# EasyEDA schematic schematic.json
TITLE: Sheet_1; REV: 1.0; Date: 2025-02-22; Sheet: 1/1; Drawn By: iminghuang08; Company: Your Company
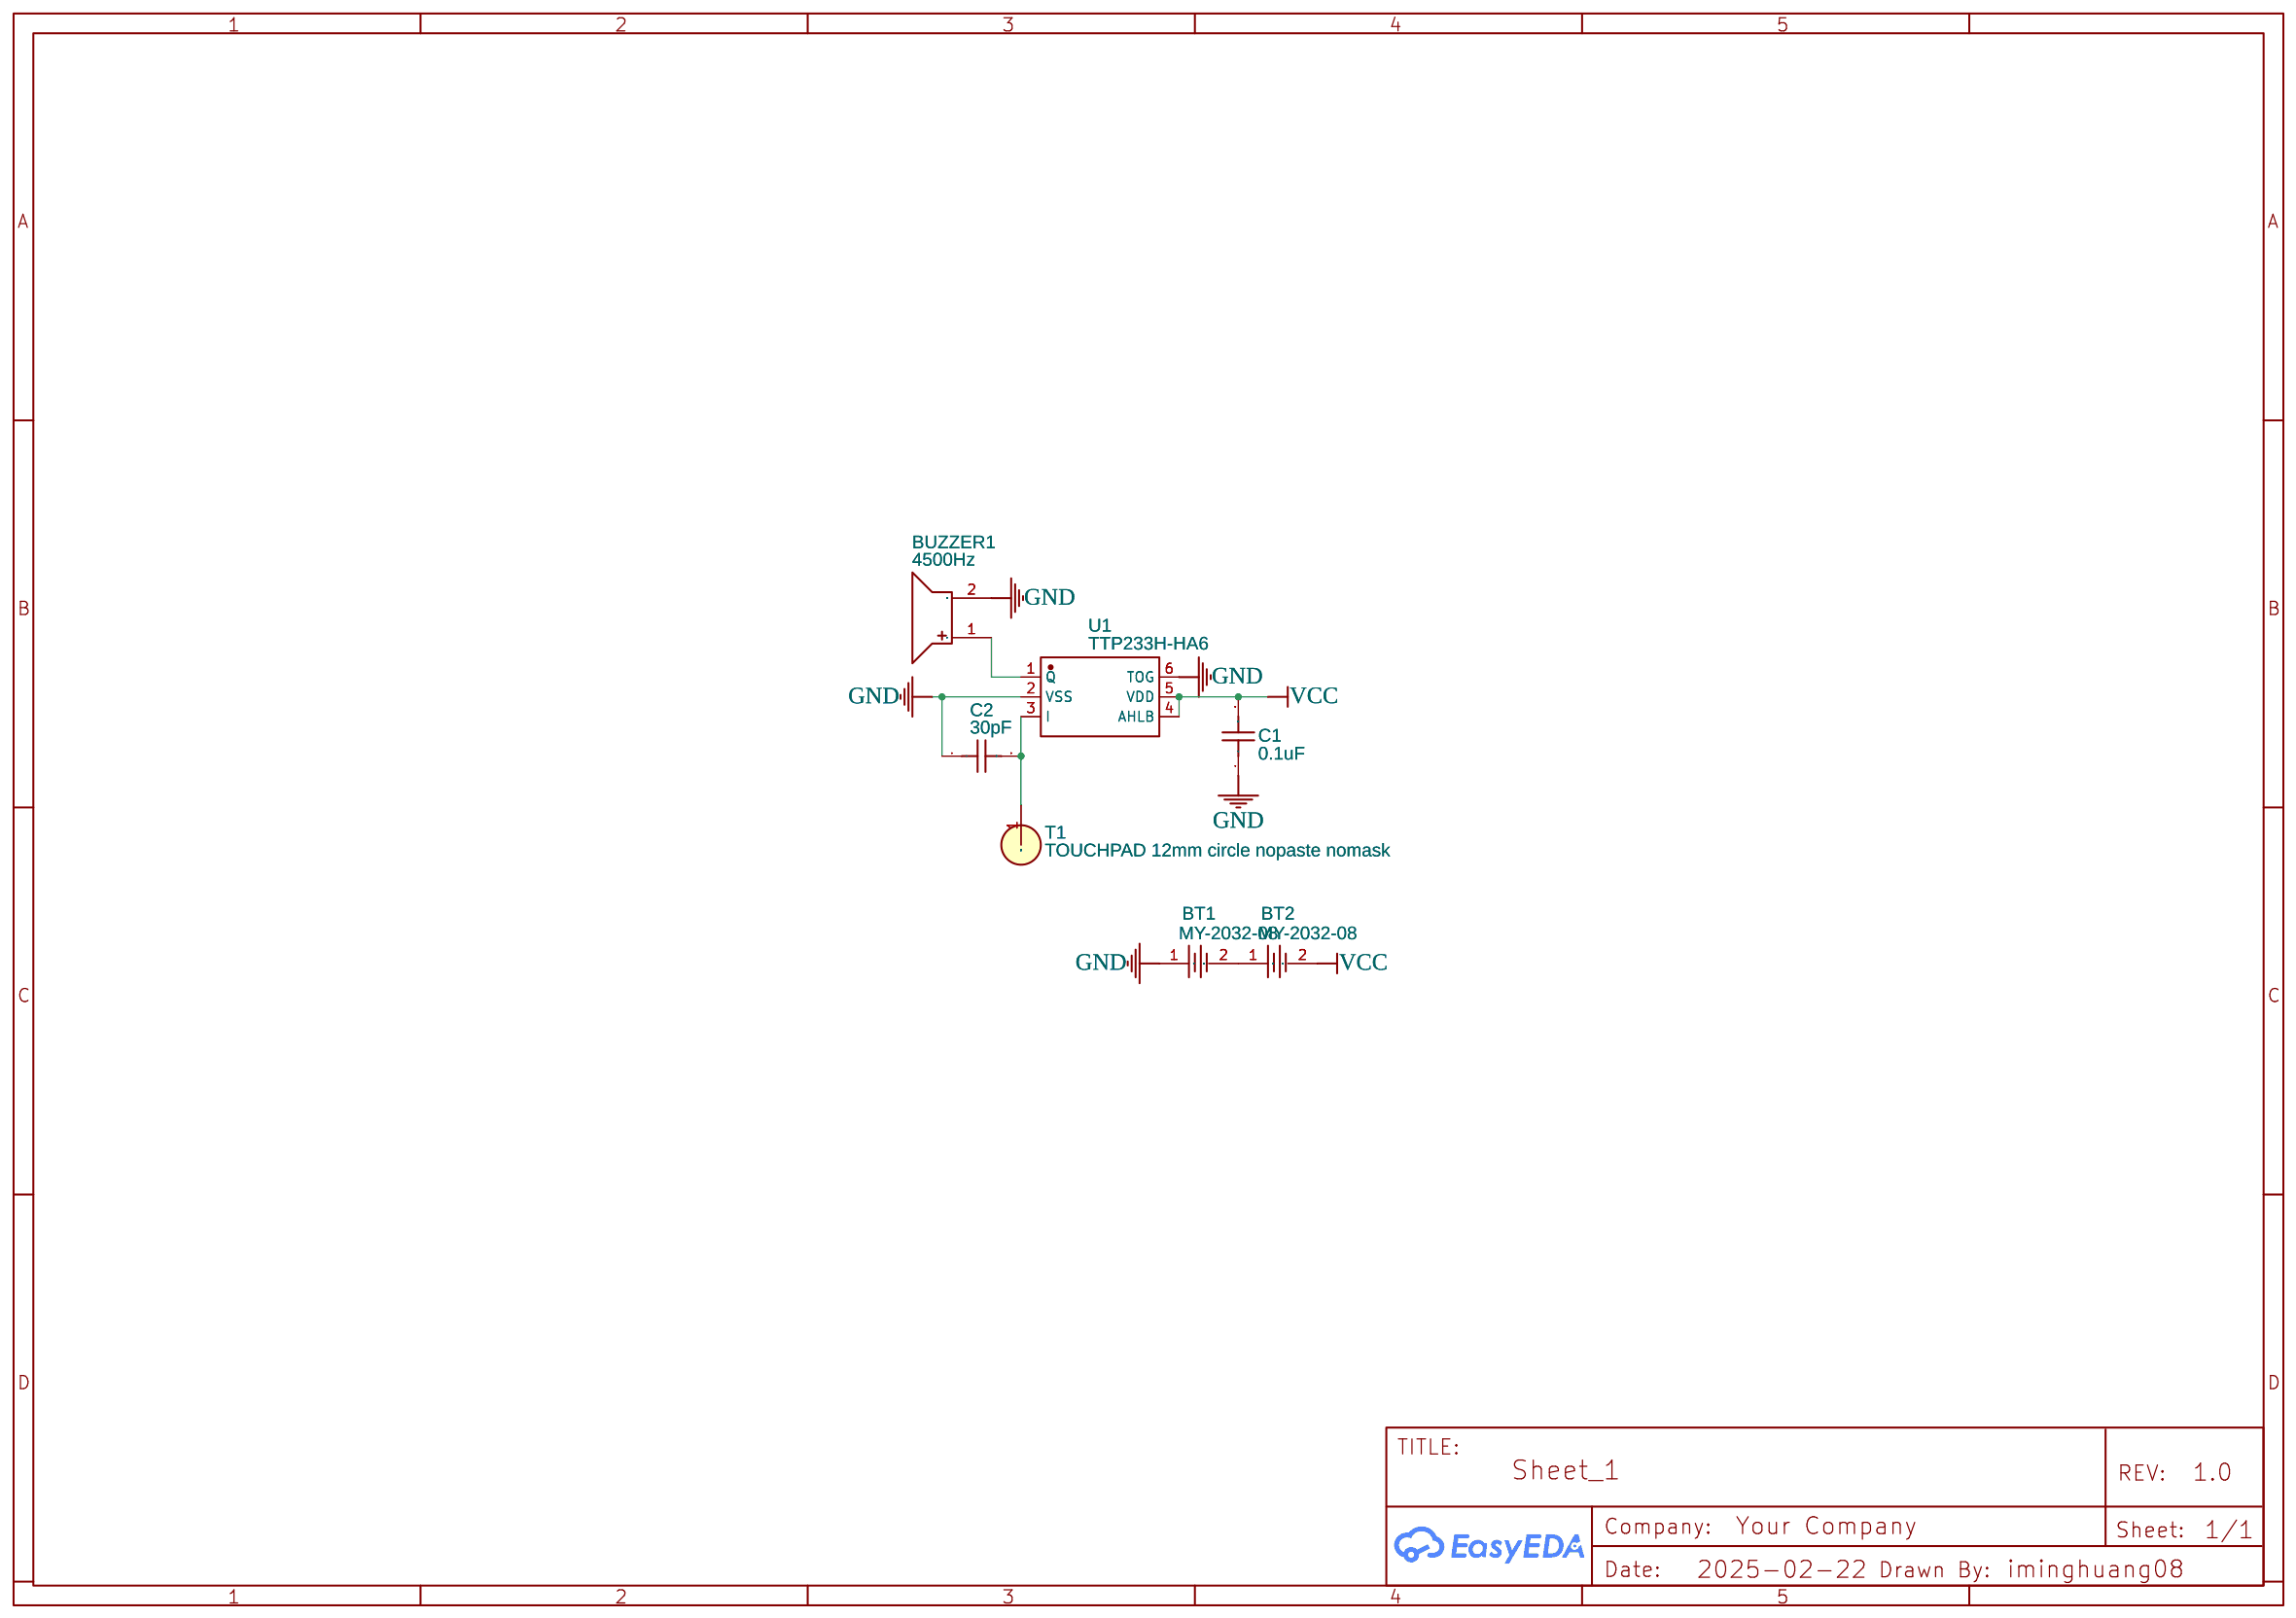
[diagram p0: schematic sheet]

## Parts
BT1  MY-2032-08  [BAT-SMD_MY-2032-08]
BT2  MY-2032-08  [BAT-SMD_MY-2032-08]
BUZZER1  4500Hz  [BUZ-TH_BD14.1-P7.62-D1.0-FD]
C1  0.1uF  [C0603]
C2  30pF  [C0603]
T1  TOUCHPAD 12mm circle nopaste nomask  [TOUCHPAD 12MM CIRCLE NOPASTE NOMASK]
U1  TTP233H-HA6  [SOT-23-6_L2.9-W1.6-P0.95-LS2.8-BL]

## Library data of the parts
BT1 BT2 = MY-2032-08: Contributor: LCSC; Supplier: LCSC; Supplier Part: C964831; Manufacturer: MYOUNG(美阳); JLCPCB Part Class: Extended Part
BUZZER1 = HND-1407B: Contributor: LCSC; Supplier: LCSC; Manufacturer: 华能; Supplier Part: C115184; JLCPCB Part Class: Extended Part
C1 C2 = C_0603_US: Contributor: LCEDA_Lib
T1 = TOUCHPAD 12mm circle nopaste nomask: Contributor: extras2765
U1 = TTP233H-HA6: Contributor: LCSC; Supplier: LCSC; Supplier Part: C2835626; Manufacturer: TONTEK(通泰); JLCPCB Part Class: Extended Part

## Nets
GND: BT1.1 BUZZER1.2 C1.1 C2.1 U1.2(VSS) U1.6(TOG)
VCC: BT2.2 C1.2 U1.4(AHLB) U1.5(VDD)
Net-(BT1-2): BT1.2 BT2.1
Net-(BUZZER1-1): BUZZER1.1 U1.1(Q)
Net-(C2-2): C2.2 T1.1(Touch) U1.3(I)
